# Altium schematic sheet XM125.SchDoc: XM125 radar module
size 420 x 297 mm; CompanyName: Acconeer AB; DrawnBy: Jonas Långbacka; Address1: Acconeer AB; Address2: Västra Varvsgatan 19; Address3: 211 77 Malmö; Address4: Sweden; SheetNumber: 1; SheetTotal: 1
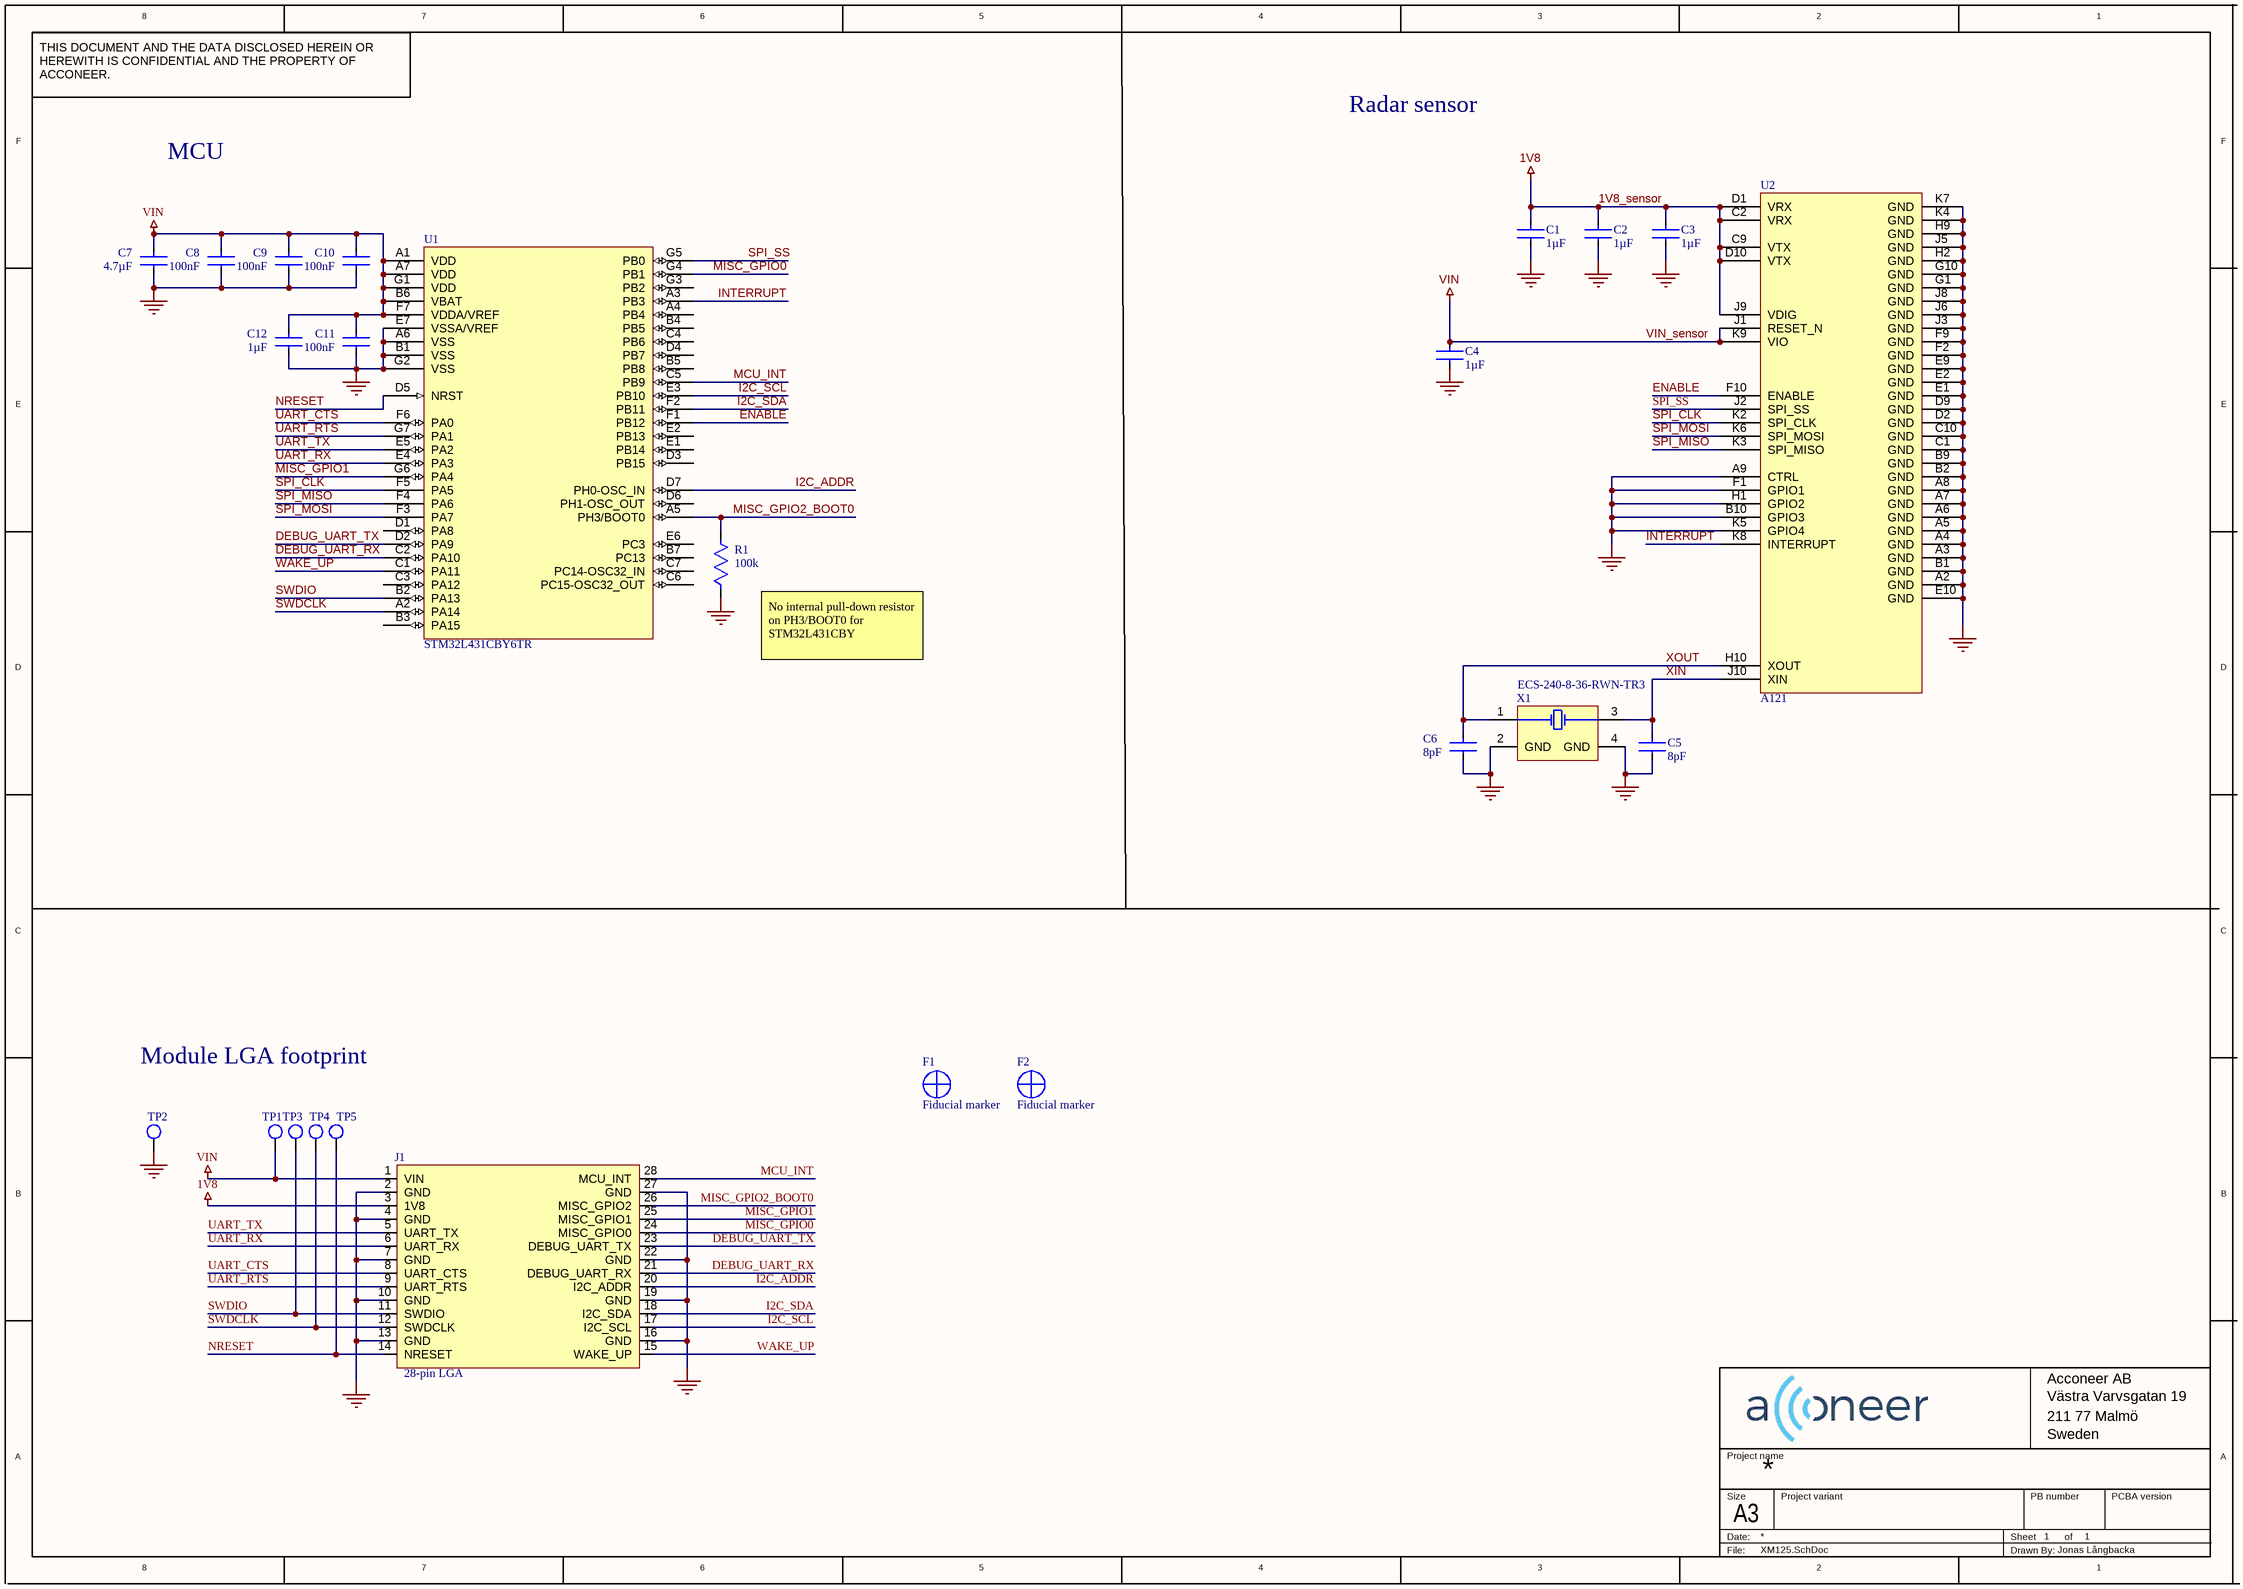
[diagram p0: XM125.SchDoc]

## Parts
C1  value 1µF  [CAPC0603X04L_no_silkscreen]  (hidden comment: Capacitor 1uF, metric 0603)
C2  value 1µF  [CAPC0603X04L_no_silkscreen]  (hidden comment: Capacitor 1uF, metric 0603)
C3  value 1µF  [CAPC0603X04L_no_silkscreen]  (hidden comment: Capacitor 1uF, metric 0603)
C4  value 1µF  [CAPC0603X04L_no_silkscreen]  (hidden comment: Capacitor 1uF, metric 0603)
C5  value 8pF  [CAPC0603X04L_no_silkscreen]  (hidden comment: Capacitor 8pF, metric 0603)
C6  value 8pF  [CAPC0603X04L_no_silkscreen]  (hidden comment: Capacitor 8pF, metric 0603)
C7  value 4.7µF  [CAPC1005X05L]  (hidden comment: Capacitor 4.7uF, metric 1005)
C8  value 100nF  [CAPC0603X04L_no_silkscreen]  (hidden comment: Capacitor 100nF, metric 0603)
C9  value 100nF  [CAPC0603X04L_no_silkscreen]  (hidden comment: Capacitor 100nF, metric 0603)
C10  value 100nF  [CAPC0603X04L_no_silkscreen]  (hidden comment: Capacitor 100nF, metric 0603)
C11  value 100nF  [CAPC0603X04L_no_silkscreen]  (hidden comment: Capacitor 100nF, metric 0603)
C12  value 1µF  [CAPC0603X04L_no_silkscreen]  (hidden comment: Capacitor 1uF, metric 0603)
F1  Fiducial marker  [Fiducial 0.5 mm footprint-1]  (no BOM)
F2  Fiducial marker  [Fiducial 0.5 mm footprint-1]  (no BOM)
J1  28-pin LGA  [LCCS127P1500X1800X0-28N]  (no BOM)
R1  value 100k  [RESC0603X03L_no_silkscreen]  (hidden comment: Resistor 100 kOhm, metric 0603)
TP1  Testpoint  [Testpoint_circular_0.8_no_silkscreen]  (value not drawn)  (no BOM)
TP2  Testpoint  [Testpoint_circular_0.8_no_silkscreen]  (value not drawn)  (no BOM)
TP3  Testpoint  [Testpoint_circular_0.8_no_silkscreen]  (value not drawn)  (no BOM)
TP4  Testpoint  [Testpoint_circular_0.8_no_silkscreen]  (value not drawn)  (no BOM)
TP5  Testpoint  [Testpoint_circular_0.8_no_silkscreen]  (value not drawn)  (no BOM)
U1  STM32L431CBY6TR  [BGA49C40P7X7_314X313X58]
U2  A121  [BGA50C50P10X10_520X550X90]
X1  ECS-240-8-36-RWN-TR3  [ECS-240-8-36-RWN-TR3-Footprint-No-Silk]

## Nets
1V8_sensor: C1.1 C2.1 C3.1 J1.3(1V8) U2.C2(VRX) U2.C9(VTX) U2.D1(VRX) U2.D10(VTX) U2.J9(VDIG)  [also labelled 1V8]
GND: C1.2 C2.2 C3.2 C4.2 C5.2 C6.2 C7.2 C8.2 C9.2 C10.2 C11.2 C12.2 J1.2(GND) J1.4(GND) J1.7(GND) J1.10(GND) J1.13(GND) J1.16(GND) J1.19(GND) J1.22(GND) J1.27(GND) R1.1 TP2.1 U1.A6(VSS) U1.B1(VSS) U1.E7(VSSA/VREF) U1.G2(VSS) U2.A2(GND) U2.A3(GND) U2.A4(GND) U2.A5(GND) U2.A6(GND) U2.A7(GND) U2.A8(GND) U2.A9(CTRL) U2.B1(GND) U2.B2(GND) U2.B9(GND) U2.B10(GPIO3) U2.C1(GND) U2.C10(GND) U2.D2(GND) U2.D9(GND) U2.E1(GND) U2.E2(GND) U2.E9(GND) U2.E10(GND) U2.F1(GPIO1) U2.F2(GND) U2.F9(GND) U2.G1(GND) U2.G10(GND) U2.H1(GPIO2) U2.H2(GND) U2.H9(GND) U2.J3(GND) U2.J5(GND) U2.J6(GND) U2.J8(GND) U2.K4(GND) U2.K5(GPIO4) U2.K7(GND) X1.2(GND) X1.4(GND)
VIN_sensor: C4.1 C7.1 C8.1 C9.1 C10.1 C11.1 C12.1 J1.1(VIN) TP1.1 U1.A1(VDD) U1.A7(VDD) U1.B6(VBAT) U1.F7(VDDA/VREF) U1.G1(VDD) U2.J1(RESET_N) U2.K9(VIO)  [also labelled VIN]
DEBUG_UART_RX: J1.21(DEBUG_UART_RX) U1.C2(PA10)
DEBUG_UART_TX: J1.23(DEBUG_UART_TX) U1.D2(PA9)
ENABLE: U1.F1(PB12) U2.F10(ENABLE)
I2C_ADDR: J1.20(I2C_ADDR) U1.D7(PH0-OSC_IN)
I2C_SCL: J1.17(I2C_SCL) U1.E3(PB10)
I2C_SDA: J1.18(I2C_SDA) U1.F2(PB11)
INTERRUPT: U1.A3(PB3) U2.K8(INTERRUPT)
MCU_INT: J1.28(MCU_INT) U1.C5(PB9)
MISC_GPIO0: J1.24(MISC_GPIO0) U1.G4(PB1)
MISC_GPIO1: J1.25(MISC_GPIO1) U1.G6(PA4)
MISC_GPIO2_BOOT0: J1.26(MISC_GPIO2) R1.2 U1.A5(PH3/BOOT0)
NRESET: J1.14(NRESET) TP5.1 U1.D5(NRST)
SPI_CLK: U1.F5(PA5) U2.K2(SPI_CLK)
SPI_MISO: U1.F4(PA6) U2.K3(SPI_MISO)
SPI_MOSI: U1.F3(PA7) U2.K6(SPI_MOSI)
SPI_SS: U1.G5(PB0) U2.J2(SPI_SS)
SWDCLK: J1.12(SWDCLK) TP4.1 U1.A2(PA14)
SWDIO: J1.11(SWDIO) TP3.1 U1.B2(PA13)
UART_CTS: J1.8(UART_CTS) U1.F6(PA0)
UART_RTS: J1.9(UART_RTS) U1.G7(PA1)
UART_RX: J1.6(UART_RX) U1.E4(PA3)
UART_TX: J1.5(UART_TX) U1.E5(PA2)
WAKE_UP: J1.15(WAKE_UP) U1.C1(PA11)
XIN: C5.1 U2.J10(XIN) X1.3(X2)
XOUT: C6.1 U2.H10(XOUT) X1.1(X1)

Not connected (* = marked no-connect by the designer): F1 1; F2 1; U1 A4(PB4) B3(PA15) B4(PB5) B5(PB8) B7(PC13) C3(PA12) C4(PB6) C6(PC15-OSC32_OUT) C7(PC14-OSC32_IN) D1(PA8) D3(PB15) D4(PB7) D6(PH1-OSC_OUT) E1(PB14) E2(PB13) E6(PC3) G3(PB2)

## Notes on the sheet
- Radar sensor
- MCU
- (near R1) No internal pull-down resistor on PH3/BOOT0 for STM32L431CBY
- Module LGA footprint
- 8
- 7
- 6
- 5
- 4
- 3
- 2
- 1
- THIS DOCUMENT AND THE DATA DISCLOSED HEREIN OR HEREWITH IS CONFIDENTIAL AND THE PROPERTY OF ACCONEER.
- F
- E
- D
- C
- B
- A
- Project name
- Size
- Date:
- A3
- Project variant
- Sheet
- PB number
- of
- PCBA version
- File:
- Drawn By:

## Library data of the parts
C1-C4 C12 = CMP-001-00106-9: Generic 1uF SMD capacitor, metric 0603 (0201); Tolerance: 20%; Voltage Rating: 10V; RoHS Compliant: Yes; Mounting Technology: SMD; Pins: 2; Max Operating Temperature: 85°C; Min Operating Temperature: -40°C; Case Code (Imperial): 0201; Case Code (Metric): 0603
C5 C6 = CMP-001-00107-7: Generic 8pF SMD capacitor, metric 0603 (0201); Voltage Rating: 10V; Tolerance: 20%; Capacitor Type: Ceramic; Temperature Coefficient: C0G, NP0; Min Operating Temperature: -40°C; RoHS Compliant: Yes; Case Code (Metric): 0603; Case Code (Imperial): 0201; Max Operating Temperature: 85°C; Pins: 2; Mounting Technology: SMD
C7 = CMP-001-00105-9: Generic 4.7uF SMD capacitor, metric 1005 (0402); Tolerance: 20%; Voltage Rating: 10V; Case Code (Metric): 1005; Case Code (Imperial): 0402; Min Operating Temperature: -40°C; Max Operating Temperature: 85°C; RoHS Compliant: Yes; Mounting Technology: SMD; Pins: 2
C8-C11 = CMP-001-00119-4: Generic 100 nF SMD capacitor, metric 0603 (0201); Tolerance: 20%; Voltage Rating: 10V; Min Operating Temperature: -40°C; Mounting Technology: SMD; Case Code (Metric): 0603; RoHS Compliant: Yes; Max Operating Temperature: 85°C; Pins: 2; Case Code (Imperial): 0201
F1 F2 = CMP-00028-00007-12
J1 = CMP-002-00117-37: 28-pin Land Grid Array (LGA), pitch 1.27 mm; Connector Type: LGA; Pins: 28
R1 = CMP-009-00221-3: 100 kOhm generic SMD resistor, +/-1%, metric 0603 (0201); Tolerance: 1%; Min Operating Temperature: -40°C; Max Operating Temperature: 85°C; RoHS Compliant: Yes; Mounting Technology: SMD; Pins: 2; Case Code (Metric): 0603; Case Code (Imperial): 0201
TP1-TP5 = CMP-00030-00001-11: Circular test point
U1 = CMP-020-00029-7: RISC Microcontroller, 32-Bit, FLASH, 80MHz, CMOS, PBGA49; Min Supply Voltage: 1.71V; Max Supply Voltage: 3.6V; RoHS Compliant: Yes; Max Operating Temperature: 85°C; Min Operating Temperature: -40°C
U2 = CMP-010-00030-4: Acconeer A121 pulsed coherent 60 GHz radar sensor; Manufacturer: Acconeer AB; Mounting Type: SMD; Min Operating Temperature: -40°C; Package Size: 5.2 x 5.5 x 0.88 mm; Package: fcCSP50; ComponentLink1Description: Datasheet; Max Operating Tempereture: 85
X1 = CMP-003-00040-8: Crystal 24 MHz 2.5 x 2.0 mm 4-SMD; Manufacturer: ECS Inc.; ESR: 60; Frequency: 24MHz; Load Capacitance: 8pF; Mounting Technology: SMD; Case/Package: 4-SMD; Min Operating Temperature: -40°C; Max Operating Temperature: 85°C; RoHS Compliant: Yes; Pins: 4